# Altium schematic sheet 10_NTC_TEMPSENSOR.SchDoc
size 420 x 297 mm; SheetNumber: 18; SheetTotal: 24
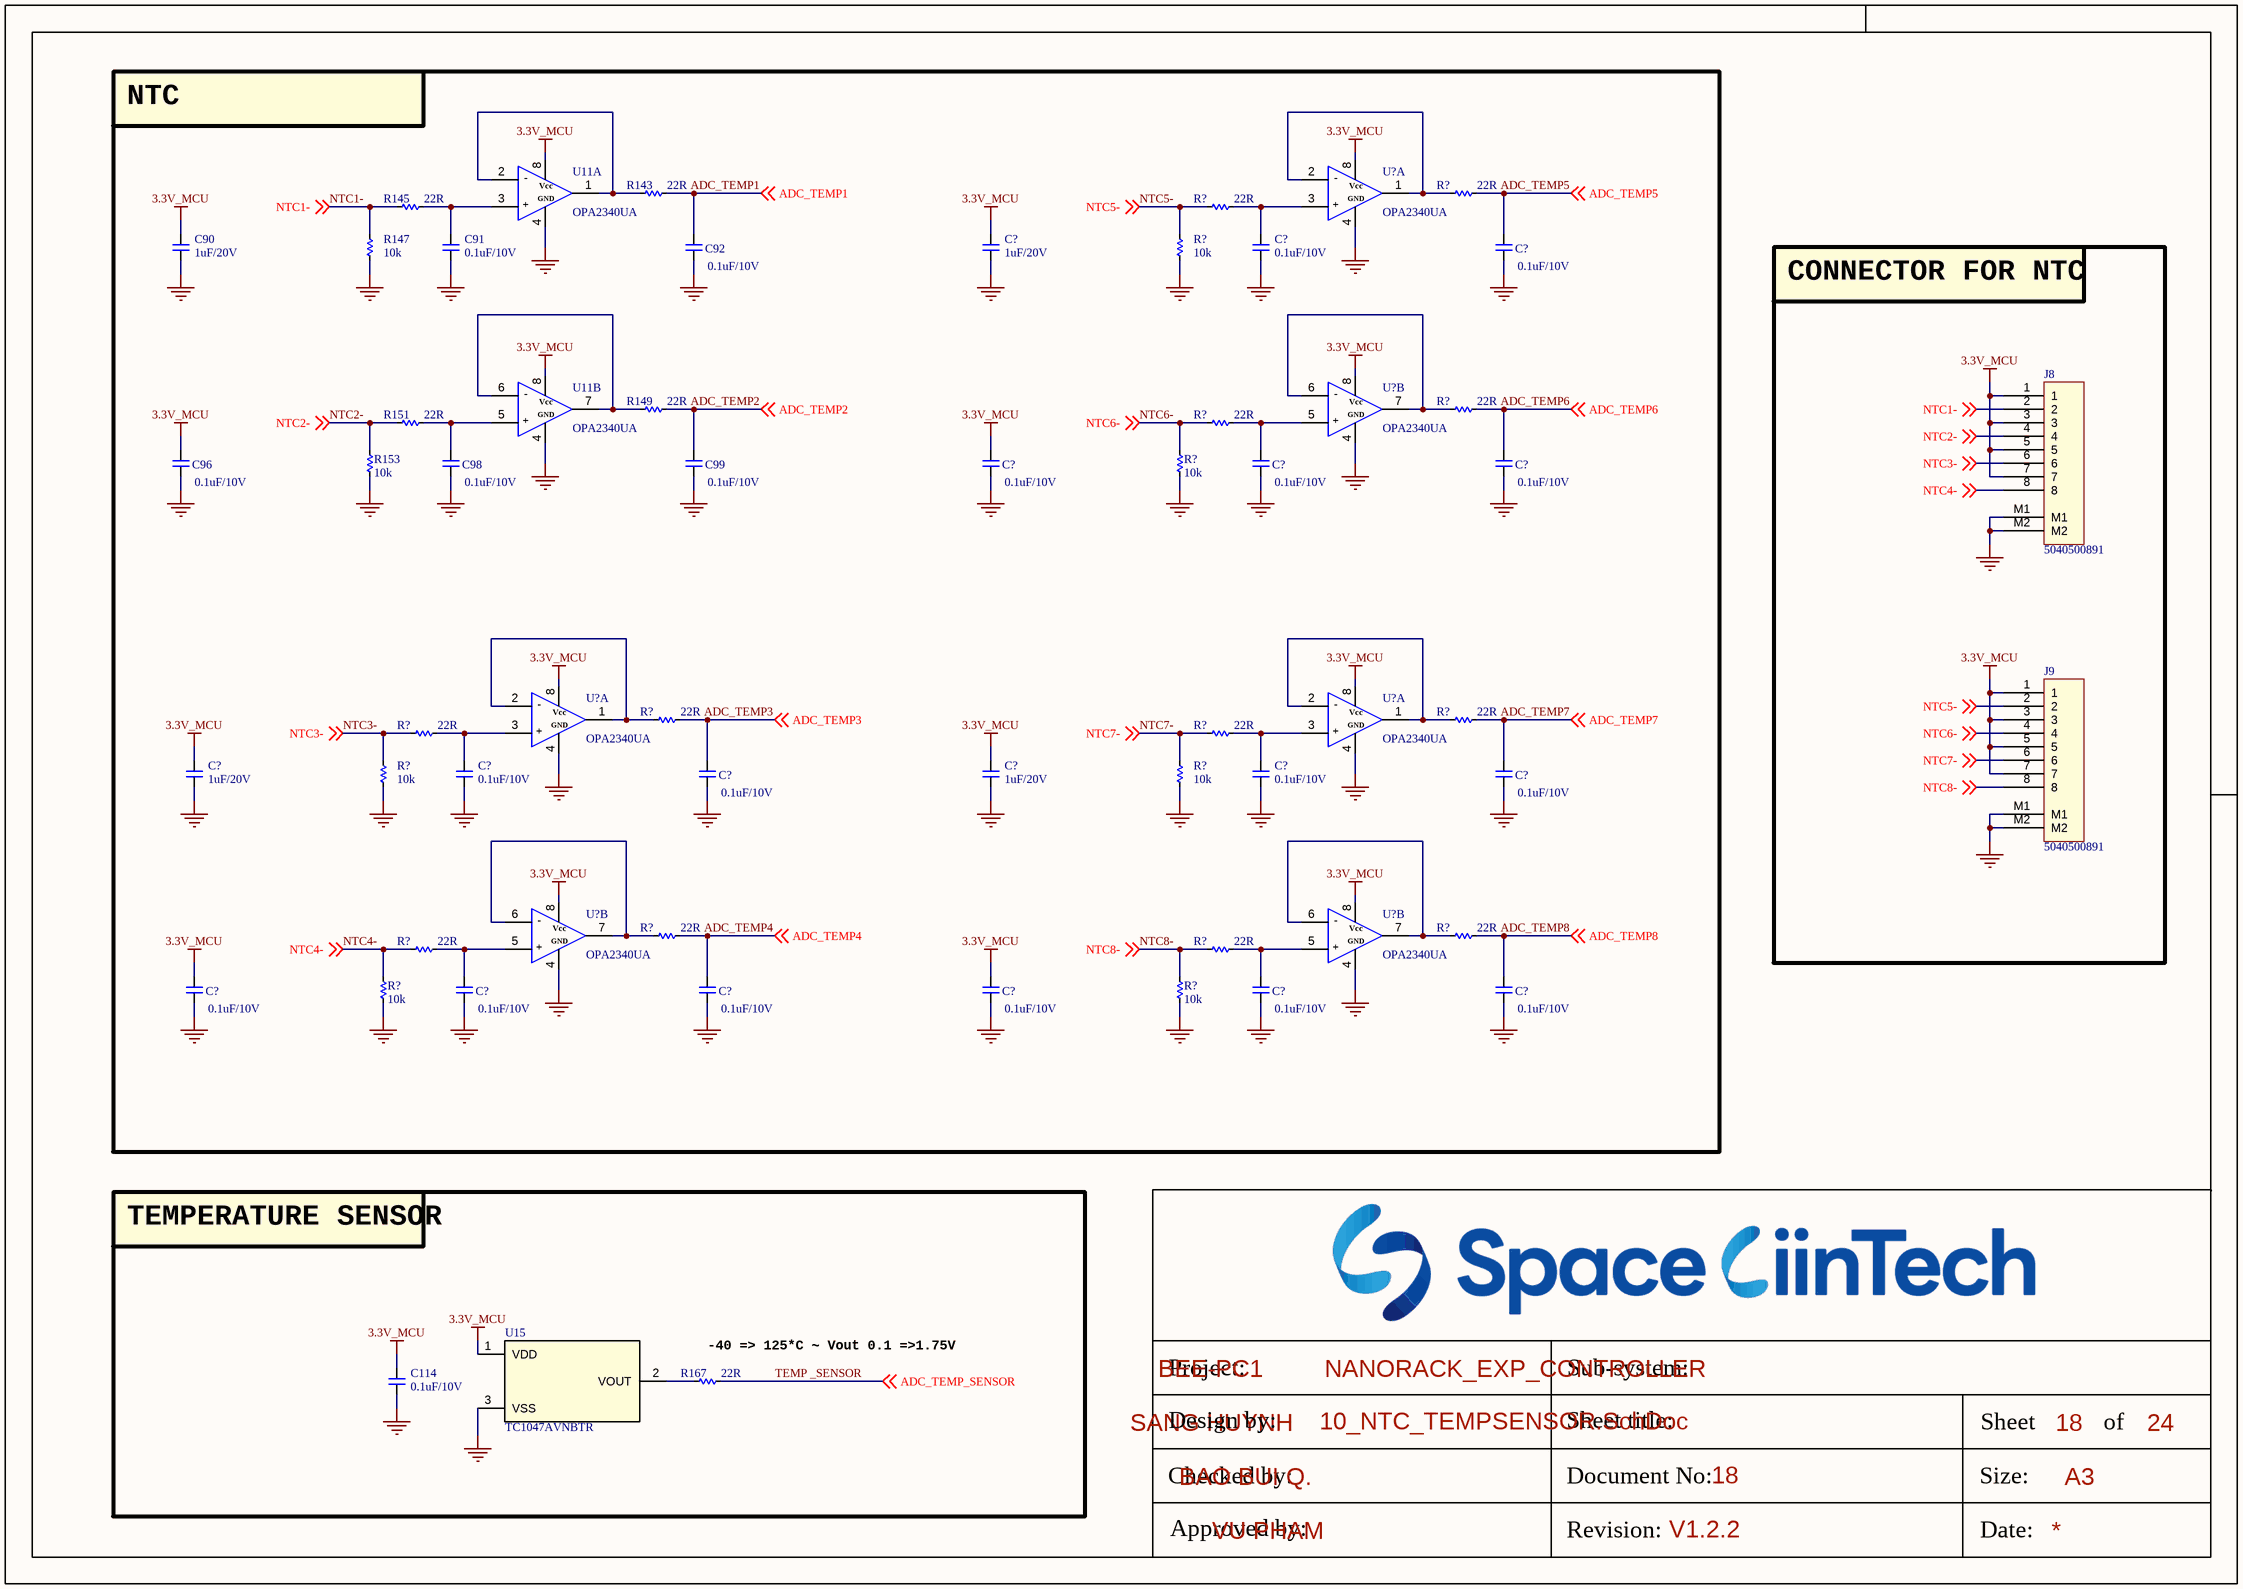
[diagram p0: 10_NTC_TEMPSENSOR.SchDoc]

## Parts
(Parts that share a designator on the sheet are numbered #1, #2 ... from top to bottom, then left to right.)
C90  1uF/20V  [CAP_C_1005X60]
C91  0.1uF/10V  [CAP_C_1005X60]
C92  0.1uF/10V  [CAP_C_1005X60]
C96  0.1uF/10V  [CAP_C_1005X60]
C98  0.1uF/10V  [CAP_C_1005X60]
C99  0.1uF/10V  [CAP_C_1005X60]
C114  0.1uF/10V  [CAP_C_1005X60]
C?#1  1uF/20V  [CAP_C_1005X60]
C?#2  0.1uF/10V  [CAP_C_1005X60]
C?#3  0.1uF/10V  [CAP_C_1005X60]
C?#4  0.1uF/10V  [CAP_C_1005X60]
C?#5  0.1uF/10V  [CAP_C_1005X60]
C?#6  0.1uF/10V  [CAP_C_1005X60]
C?#7  1uF/20V  [CAP_C_1005X60]
C?#8  0.1uF/10V  [CAP_C_1005X60]
C?#9  0.1uF/10V  [CAP_C_1005X60]
C?#10  1uF/20V  [CAP_C_1005X60]
C?#11  0.1uF/10V  [CAP_C_1005X60]
C?#12  0.1uF/10V  [CAP_C_1005X60]
C?#13  0.1uF/10V  [CAP_C_1005X60]
C?#14  0.1uF/10V  [CAP_C_1005X60]
C?#15  0.1uF/10V  [CAP_C_1005X60]
C?#16  0.1uF/10V  [CAP_C_1005X60]
C?#17  0.1uF/10V  [CAP_C_1005X60]
C?#18  0.1uF/10V  [CAP_C_1005X60]
J8  5040500891  [MOLEX_5040500891]
J9  5040500891  [MOLEX_5040500891]
R143  22R  [RES_C_1005X40]
R145  22R  [RES_C_1005X40]
R147  10k  [RES_C_1005X40]
R149  22R  [RES_C_1005X40]
R151  22R  [RES_C_1005X40]
R153  10k  [RES_C_1005X40]
R167  22R  [RES_C_1005X40]
R?#1  22R  [RES_C_1005X40]
R?#2  22R  [RES_C_1005X40]
R?#3  10k  [RES_C_1005X40]
R?#4  22R  [RES_C_1005X40]
R?#5  22R  [RES_C_1005X40]
R?#6  10k  [RES_C_1005X40]
R?#7  22R  [RES_C_1005X40]
R?#8  22R  [RES_C_1005X40]
R?#9  22R  [RES_C_1005X40]
R?#10  22R  [RES_C_1005X40]
R?#11  10k  [RES_C_1005X40]
R?#12  10k  [RES_C_1005X40]
R?#13  22R  [RES_C_1005X40]
R?#14  22R  [RES_C_1005X40]
R?#15  22R  [RES_C_1005X40]
R?#16  22R  [RES_C_1005X40]
R?#17  10k  [RES_C_1005X40]
R?#18  10k  [RES_C_1005X40]
U11  OPA2340UA  [SOIC127P602X173-8N]  (parts A,B of 2)
U15  TC1047AVNBTR  [SOT95P240X120-3N]
U?#1  OPA2340UA  [SOIC127P602X173-8N]  (part A of 2)
U?#2  OPA2340UA  [SOIC127P602X173-8N]  (part B of 2)
U?#3  OPA2340UA  [SOIC127P602X173-8N]  (part A of 2)
U?#4  OPA2340UA  [SOIC127P602X173-8N]  (part A of 2)
U?#5  OPA2340UA  [SOIC127P602X173-8N]  (part B of 2)
U?#6  OPA2340UA  [SOIC127P602X173-8N]  (part B of 2)

## Blocks framed on the sheet
NTC: C90-C92 C96 C98 C99 C?#1-C?#18 R143 R145 R147 R149 R151 R153 R?#1-R?#18 U11 U?#1-U?#6
CONNECTOR FOR NTC: J8 J9
TEMPERATURE SENSOR: C114 R167 U15

## Nets
3.3V_MCU: C90.2 C96.2 C114.2 C?#1.2 C?#4.2 C?#7.2 C?#10.2 C?#13.2 C?#16.2 J8.1 J8.3 J8.5 J8.7 J9.1 J9.3 J9.5 J9.7 U11.8 U15.1(VDD) U?#1.8 U?#2.8 U?#3.8 U?#4.8 U?#5.8 U?#6.8
GND: C90.1 C91.1 C92.1 C96.1 C98.1 C99.1 C114.1 C?#1.1 C?#2.1 C?#3.1 C?#4.1 C?#5.1 C?#6.1 C?#7.1 C?#8.1 C?#9.1 C?#10.1 C?#11.1 C?#12.1 C?#13.1 C?#14.1 C?#15.1 C?#16.1 C?#17.1 C?#18.1 J8.M1 J8.M2 J9.M1 J9.M2 R147.1 R153.1 R?#3.1 R?#6.1 R?#11.1 R?#12.1 R?#17.1 R?#18.1 U11.4 U15.3(VSS) U?#1.4 U?#2.4 U?#3.4 U?#4.4 U?#5.4 U?#6.4
ADC_TEMP1: C92.2 R143.2 ; off-sheet ADC_TEMP1
ADC_TEMP2: C99.2 R149.2 ; off-sheet ADC_TEMP2
ADC_TEMP3: C?#9.2 R?#7.2 ; off-sheet ADC_TEMP3
ADC_TEMP4: C?#15.2 R?#13.2 ; off-sheet ADC_TEMP4
ADC_TEMP5: C?#3.2 R?#1.2 ; off-sheet ADC_TEMP5
ADC_TEMP6: C?#6.2 R?#4.2 ; off-sheet ADC_TEMP6
ADC_TEMP7: C?#12.2 R?#8.2 ; off-sheet ADC_TEMP7
ADC_TEMP8: C?#18.2 R?#14.2 ; off-sheet ADC_TEMP8
NTC1-: J8.2 R145.1 R147.2 ; off-sheet NTC1-
NTC2-: J8.4 R151.1 R153.2 ; off-sheet NTC2-
NTC3-: J8.6 R?#9.1 R?#11.2 ; off-sheet NTC3-
NTC4-: J8.8 R?#15.1 R?#17.2 ; off-sheet NTC4-
NTC5-: J9.2 R?#2.1 R?#3.2 ; off-sheet NTC5-
NTC6-: J9.4 R?#5.1 R?#6.2 ; off-sheet NTC6-
NTC7-: J9.6 R?#10.1 R?#12.2 ; off-sheet NTC7-
NTC8-: J9.8 R?#16.1 R?#18.2 ; off-sheet NTC8-
TEMP _SENSOR: R167.2 ; off-sheet ADC_TEMP_SENSOR  [also labelled ADC_TEMP_SENSOR]
NetC91_2: C91.2 R145.2 U11.3
NetC98_2: C98.2 R151.2 U11.5
NetC?#2_2: C?#2.2 R?#2.2 U?#1.3
NetC?#5_2: C?#5.2 R?#5.2 U?#2.5
NetC?#8_2: C?#8.2 R?#9.2 U?#3.3
NetC?#11_2: C?#11.2 R?#10.2 U?#4.3
NetC?#14_2: C?#14.2 R?#15.2 U?#5.5
NetC?#17_2: C?#17.2 R?#16.2 U?#6.5
NetR143_1: R143.1 U11.1 U11.2
NetR149_1: R149.1 U11.6 U11.7
NetR167_1: R167.1 U15.2(VOUT)
NetR?#1_1: R?#1.1 U?#1.1 U?#1.2
NetR?#4_1: R?#4.1 U?#2.6 U?#2.7
NetR?#7_1: R?#7.1 U?#3.1 U?#3.2
NetR?#8_1: R?#8.1 U?#4.1 U?#4.2
NetR?#13_1: R?#13.1 U?#5.6 U?#5.7
NetR?#14_1: R?#14.1 U?#6.6 U?#6.7

## Notes on the sheet
- (near R167) -40 => 125*C ~ Vout 0.1 =>1.75V
- Project:
- BEE-PC1
- Sub-system:
- NANORACK_EXP_CONTROLLER
- Design by:
- SANG HUYNH
- BAO BUI Q.
- Sheet title:
- Sheet
- A3
- of
- Checked by:
- Approved by:
- VU PHAM
- Revision:
- Document No:
- V1.2.2
- Size:
- Date:
- (in symbol OPA2340UA, part A) -; Vcc; GND; +
- (in symbol OPA2340UA, part B) -; Vcc; GND; +

## Library data of the parts
C90-C92 C96 C98 C99 C114 C?#1-C?#18 = _CAP_C_2: CAP CHIP
J8 J9 = Header 8x1_2M
R143 R145 R147 R149 R151 R153 R167 R?#1-R?#18 = _RES_B_2: RES
U15 = IC_SENSOR_TC1047AVNBTR: Temperature Sensor Analog, Local -40°C ~ 125°C 10mV/°C SOT-23-3